# Altium schematic sheet DEVICES.SchDoc
size A4
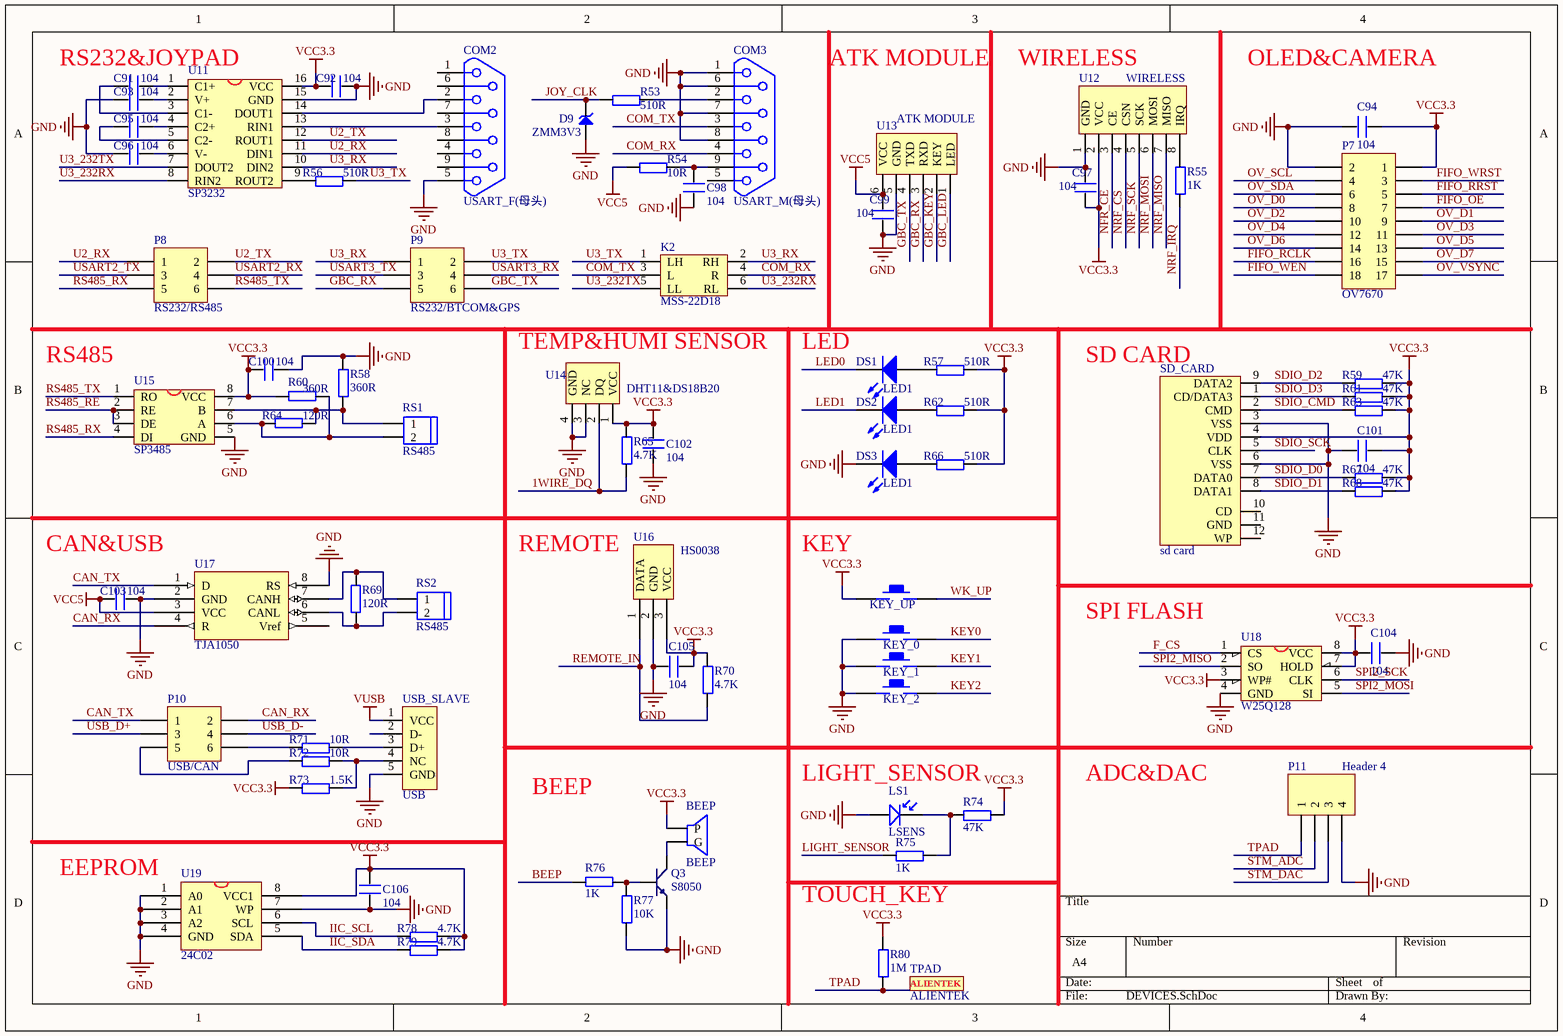
[diagram p0: DEVICES.SchDoc]

## Parts
BEEP  BEEP  [BELL-5]
C91  104  [0603P]
C92  104  [0603P]
C93  104  [0603P]
C94  104  [0603P]
C95  104  [0603P]
C96  104  [0603P]
C97  104  [0603P]
C98  104  [0603P]
C99  104  [0603P]
C100  104  [0603P]
C101  104  [0603P]
C102  104  [0603P]
C103  104  [0603P]
C104  104  [0603P]
C105  104  [0603P]
C106  104  [0603P]
COM2  USART_F(母头)  [DB9]
COM3  USART_M(母头)  [DB9]
D9  ZMM3V3  [DIODE_ZMMx]
DS1  LED1  [SMDLED]
DS2  LED1  [SMDLED]
DS3  LED1  [SMDLED]
K2  MSS-22D18  [MSS-22D18-DIP]
KEY_0  KEY_M  [KEY_M]  (value not drawn)
KEY_1  KEY_M  [KEY_M]  (value not drawn)
KEY_2  KEY_M  [KEY_M]  (value not drawn)
KEY_UP  KEY_M  [KEY_M]  (value not drawn)
LS1  LSENS  [SMDLED]
P7  OV7670  [HDR2X9]
P8  RS232/RS485  [HDR2X3]
P9  RS232/BTCOM&GPS  [HDR2X3]
P10  USB/CAN  [HDR2X3]
P11  Header 4  [HDR1X4]
Q3  S8050  [SOT-23R]
R53  510R  [0603P]
R54  10R  [0603P]
R55  1K  [0603P]
R56  510R  [0603P]
R57  510R  [0603P]
R58  360R  [0603P]
R59  47K  [0603P]
R60  360R  [0603P]
R61  47K  [0603P]
R62  510R  [0603P]
R63  47K  [0603P]
R64  120R  [0603P]
R65  4.7K  [0603P]
R66  510R  [0603P]
R67  47K  [0603P]
R68  47K  [0603P]
R69  120R  [0603P]
R70  4.7K  [0603P]
R71  10R  [0603P]
R72  10R  [0603P]
R73  1.5K  [0603P]
R74  47K  [0603P]
R75  1K  [0603P]
R76  1K  [0603P]
R77  10K  [0603P]
R78  4.7K  [0603P]
R79  4.7K  [0603P]
R80  1M  [0603P]
RS1  RS485  [HEAD2L-0.8]
RS2  RS485  [HEAD2L-0.8]
SD_CARD  sd card  [SDCARD_L]
TPAD  ALIENTEK  [ALIENTEK_PAD1]
U11  SP3232  [SOP16M]
U12  WIRELESS  [NRF24L01]
U13  ATK MODULE  [HEAD6]
U14  DHT11&DS18B20  [DHT11]
U15  SP3485  [SOP-8]
U16  HS0038  [HS0038]
U17  TJA1050  [SOP-8]
U18  W25Q128  [SOIC-8]
U19  24C02  [SOP-8]
USB_SLAVE  USB  [USB/SM0.8-6H5]

## Nets
GND: C92.2 C93.1 C94.2 C96.1 C97.2 C98.1 C99.1 C100.2 C101.2 C102.1 C103.2 C104.1 C105.2 C106.1 COM2.5 COM3.1 COM3.6 COM3.7 COM3.8 D9.1 DS3.2(K) KEY_0.1 KEY_1.1 KEY_2.1 LS1.1 P7.2 P11.4 Q3.1(E) R58.2 R77.1 SD_CARD.3(VSS) SD_CARD.6(VSS) U11.15(GND) U12.1(GND) U13.5(GND) U14.3(NC) U14.4(GND) U15.5(GND) U16.2(GND) U17.2(GND) U17.8(RS) U18.4(GND) U19.1(A0) U19.2(A1) U19.3(A2) U19.4(GND) U19.7(WP) USB_SLAVE.5(GND)
VCC3.3: BEEP.1(P) C92.1 C94.1 C97.1 C100.1 C101.1 C102.2 C104.2 C105.1 C106.2 KEY_UP.1 P7.1 R57.2 R59.2 R60.2 R61.2 R62.2 R63.2 R65.2 R66.2 R67.2 R68.2 R70.2 R73.1 R74.2 R78.2 R79.2 R80.2 SD_CARD.4(VDD) U11.16(VCC) U12.2(VCC) U14.1(VCC) U15.8(VCC) U16.3(VCC) U18.3(WP#) U18.7(HOLD) U18.8(VCC) U19.8(VCC1)
VCC5: C99.2 C103.1 R54.1 U13.6(VCC) U17.3(VCC)
VUSB: USB_SLAVE.1(VCC)
1WIRE_DQ: R65.1 U14.2(DQ)
BEEP: R76.2
CAN_RX: P10.2 U17.4(R)
CAN_TX: P10.1 U17.1(D)
COM_RX: COM3.4 K2.4(R)
COM_TX: COM3.3 K2.3(L)
F_CS: U18.1(CS)
FIFO_OE: P7.7
FIFO_RCLK: P7.16
FIFO_RRST: P7.5
FIFO_WEN: P7.18
FIFO_WRST: P7.3
GBC_KEY: U13.2(KEY)
GBC_LED: U13.1(LED)
GBC_RX: P9.5 U13.3(RXD)
GBC_TX: P9.6 U13.4(TXD)
IIC_SCL: R78.1 U19.6(SCL)
IIC_SDA: R79.1 U19.5(SDA)
JOY_CLK: D9.2 R53.1
KEY0: KEY_0.2
KEY1: KEY_1.2
KEY2: KEY_2.2
LED0: DS1.2(K)
LED1: DS2.2(K)
LIGHT_SENSOR: R75.1
NFR_CE: U12.3(CE)
NRF_CS: U12.4(CSN)
NRF_IRQ: R55.1
NRF_MISO: U12.7(MISO)
NRF_MOSI: U12.6(MOSI)
NRF_SCK: U12.5(SCK)
OV_D0: P7.8
OV_D1: P7.9
OV_D2: P7.10
OV_D3: P7.11
OV_D4: P7.12
OV_D5: P7.13
OV_D6: P7.14
OV_D7: P7.15
OV_SCL: P7.4
OV_SDA: P7.6
OV_VSYNC: P7.17
REMOTE_IN: R70.1 U16.1(DATA)
RS485_RE: U15.2(RE) U15.3(DE)
RS485_RX: P8.5 U15.4(DI)
RS485_TX: P8.6 U15.1(RO)
SDIO_CMD: R63.1 SD_CARD.2(CMD)
SDIO_D0: R67.1 SD_CARD.7(DATA0)
SDIO_D1: R68.1 SD_CARD.8(DATA1)
SDIO_D2: R59.1 SD_CARD.9(DATA2)
SDIO_D3: R61.1 SD_CARD.1(CD/DATA3)
SDIO_SCK: SD_CARD.5(CLK)
SPI2_MISO: U18.2(SO)
SPI2_MOSI: U18.5(SI)
SPI2_SCK: U18.6(CLK)
STM_ADC: P11.2
STM_DAC: P11.3
TPAD: P11.1 R80.1
U2_RX: P8.1 U11.11(DIN1)
U2_TX: P8.2 U11.12(ROUT1)
U3_232RX: K2.6(RL) U11.8(RIN2)
U3_232TX: K2.5(LL) U11.7(DOUT2)
U3_RX: K2.2(RH) P9.1 U11.10(DIN2)
U3_TX: K2.1(LH) P9.2 R56.2
USART2_RX: P8.4
USART2_TX: P8.3
USART3_RX: P9.4
USART3_TX: P9.3
USB_D+: P10.3
USB_D-: P10.4
WK_UP: KEY_UP.2
NetBEEP_2: BEEP.2(G) Q3.3(C)
NetC91_1: C91.1 U11.3(C1-)
NetC91_2: C91.2 U11.1(C1+)
NetC93_2: C93.2 U11.2(V+)
NetC95_1: C95.1 U11.5(C2-)
NetC95_2: C95.2 U11.4(C2+)
NetC96_2: C96.2 U11.6(V-)
NetC98_2: C98.2 COM3.9 R54.2
NetCOM2_2: COM2.2 U11.14(DOUT1)
NetCOM2_3: COM2.3 U11.13(RIN1)
NetCOM3_2: COM3.2 R53.2
NetDS1_1: DS1.1(A) R57.1
NetDS2_1: DS2.1(A) R62.1
NetDS3_1: DS3.1(A) R66.1
NetLS1_2: LS1.2 R74.1 R75.2
NetP10_5: P10.5 R72.1
NetP10_6: P10.6 R71.1
NetQ3_2: Q3.2(B) R76.1 R77.2
NetR55_2: R55.2 U12.8(IRQ)
NetR56_1: R56.1 U11.9(ROUT2)
NetR58_1: R58.1 R64.1 RS1.1 U15.7(B)
NetR60_1: R60.1 R64.2 RS1.2 U15.6(A)
NetR69_1: R69.1 RS2.1 U17.7(CANH)
NetR69_2: R69.2 RS2.2 U17.6(CANL)
NetR71_2: R71.2 USB_SLAVE.3(D+)
NetR72_2: R72.2 R73.2 USB_SLAVE.4(NC)

Not connected (* = marked no-connect by the designer): COM2 1 4 6 7 8 9; COM3 5; SD_CARD 10(CD) 11(GND) 12(WP); U17 5(Vref); USB_SLAVE 2(D-)

## Notes on the sheet
- RS232&JOYPAD
- ATK MODULE
- WIRELESS
- OLED&CAMERA
- (near U15) RS485
- TEMP&HUMI SENSOR
- LED
- SD CARD
- (near C103) CAN&USB
- REMOTE
- KEY
- SPI FLASH
- LIGHT_SENSOR
- ADC&DAC
- BEEP
- (near U19) EEPROM
- TOUCH_KEY

## Library data of the parts
C91-C106 = C
COM2 COM3 = DB9
D9 = ZMM3V6
DS1-DS3 = LED2: Typical RED, GREEN, YELLOW, AMBER GaAs LED; Published: 8-Jun-2000; LatestRevisionDate: 17-Jul-2002; LatestRevisionNote: Re-released for DXP Platform.; PackageDocument: Feb-2002; PackageReference: 3.2X1.6X1.1; Publisher: Altium Limited
K2 = MSS-22D18: 六脚波动开关
LS1 = LSENS: LIGHT SENS
P7 = Header 9X2: Header, 9-Pin, Dual row; LatestRevisionDate: 17-Jul-2002; LatestRevisionNote: Re-released for DXP Platform.; Publisher: Altium Limited
P8-P10 = Header 3X2: Header, 3-Pin, Dual row; LatestRevisionDate: 17-Jul-2002; LatestRevisionNote: Re-released for DXP Platform.; Publisher: Altium Limited
P11 = Header 4: Header, 4-Pin; LatestRevisionDate: 17-Jul-2002; LatestRevisionNote: Re-released for DXP Platform.; Publisher: Altium Limited
Q3 = NPN: 8050/BCW846/BCW847
R53-R80 = R
RS1 RS2 = HEAD2
U11 = MAX3232
U12 = NRF24L01
U13 = ATK-HC05
U14 = DHT11: 数字温湿度传感器
U15 = MAX3485
U17 = SN65HVD230D
U18 = W25X16: W25X16;SST25VF016;MX25L1605
U19 = 24C256
USB_SLAVE = USB5